# Altium schematic sheet LVDS_Driver_Subsystem.SchDoc
size A; SheetNumber: 5; SheetTotal: 6
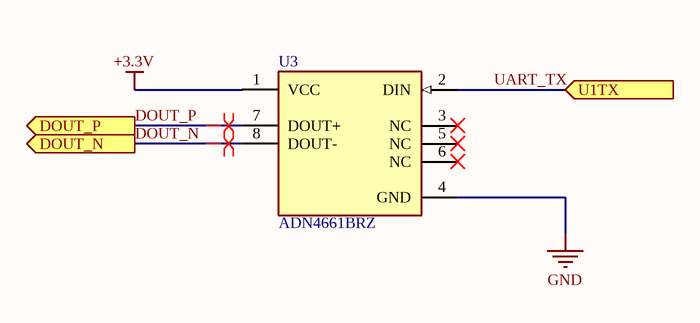
[diagram p0: LVDS_Driver_Subsystem.SchDoc]

## Parts
U3  ADN4661BRZ  [FP-R-8-IPC_A]

## Ports
DOUT_N (out), DOUT_P (out), U1TX (in)

## Nets
+3.3V: U3.1(VCC)
GND: U3.4(GND)
DOUT_N: U3.8(DOUT-) ; port DOUT_N
DOUT_P: U3.7(DOUT+) ; port DOUT_P
UART_TX: U3.2(DIN) ; port U1TX

Not connected (* = marked no-connect by the designer): U3 3(NC)* 5(NC)* 6(NC)*

## Layout directives
differential pair: DOUT_N, DOUT_P

## Library data of the parts
U3 = CMP-09093-000114-1: IC DRIVER 1/0 8SOIC; Supply Current: 7mA; Number of Receivers: 1; Min Supply Voltage: 3V; Max Supply Current: 10mA; Max Supply Voltage: 3.6V; Turn-On Delay Time: 1.5ns; Data Rate: 600Mbps; Operating Supply Voltage: 3.3V; Length: 5mm; Series: -; Number of Pins: 8; REACH SVHC: No SVHC; Mount: Surface Mount; RoHS Compliant: Yes; Packaging: Rail/Tube; Nominal Supply Current: 7mA; Radiation Hardening: No; Number of Drivers: 1; Width: 4mm; Number of Elements: 1; Lead Free: Contains Lead; Operating Supply Current: 7mA; Min Operating Temperature: -40°C; Propagation Delay: 1.5ns; Package Quantity: 98; Height: 1.5mm; Case/Package: SOIC; Max Operating Temperature: 85°C